# Altium schematic sheet MOUNTING_HOLE.SchDoc
size 420 x 297 mm; SheetNumber: 27; SheetTotal: 32
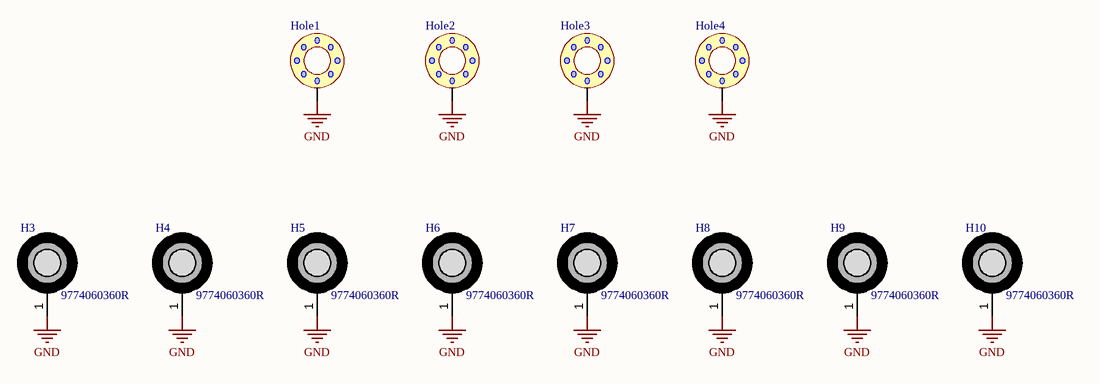
[diagram p0: MOUNTING_HOLE.SchDoc]

## Parts
H3  9774060360R  [M4.4]
H4  9774060360R  [M4.4]
H5  9774060360R  [M4.4]
H6  9774060360R  [M4.4]
H7  9774060360R  [M4.4]
H8  9774060360R  [M4.4]
H9  9774060360R  [M4.4]
H10  9774060360R  [M4.4]
Hole1  hole_space  [HEX-M3_NoVia]  (value not drawn)
Hole2  hole_space  [HEX-M3_NoVia]  (value not drawn)
Hole3  hole_space  [HEX-M3_NoVia]  (value not drawn)
Hole4  hole_space  [HEX-M3_NoVia]  (value not drawn)

## Nets
GND: H3.1 H4.1 H5.1 H6.1 H7.1 H8.1 H9.1 H10.1 Hole1.1 Hole2.1 Hole3.1 Hole4.1

## Notes on the sheet
- Project:
- Sub-system:
- Design by:
- Sheet title:
- Sheet
- A3
- of
- Checked by:
- Approved by:
- Revision:
- Document No:
- Size:
- Date:

## Library data of the parts
H3-H10 = M4.4: WA-SMSI SMT Steel Spacer with / internal Thread